# Altium schematic sheet MotherBoard.SchDoc
size A4
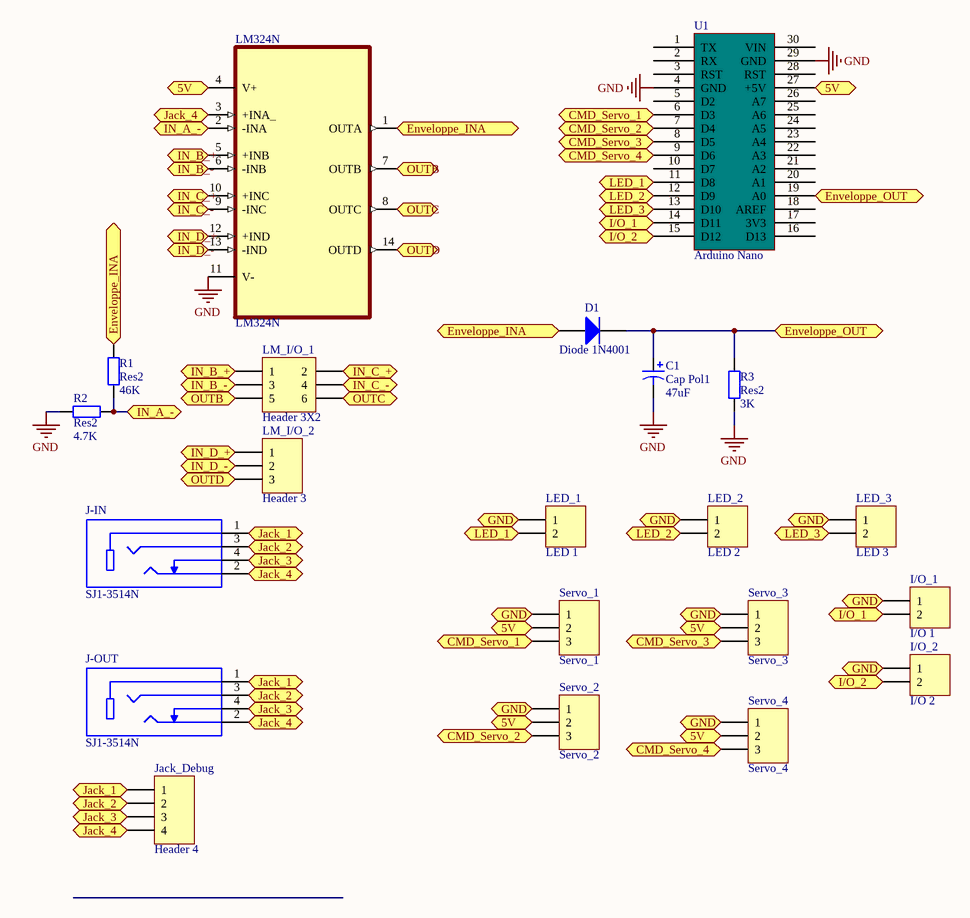
[diagram p0: MotherBoard.SchDoc]

## Parts
C1  Cap Pol1  value 47uF  [RB7.6-15]
D1  Diode 1N4001  [DO-41]
I/O_1  I/O 1  [HDR1X2]
I/O_2  I/O 2  [HDR1X2]
J-IN  SJ1-3514N  [CUI_SJ1-3514N]
J-OUT  SJ1-3514N  [CUI_SJ1-3514N]
Jack_Debug  Header 4  [HDR1X4]
LED_1  LED 1  [HDR1X2]
LED_2  LED 2  [HDR1X2]
LED_3  LED 3  [HDR1X2]
LM324N  LM324N  [DIP254P762X508-14]
LM_I/O_1  Header 3X2  [HDR2X3]
LM_I/O_2  Header 3  [HDR1X3]
R1  Res2  value 46K  [AXIAL-0.4]
R2  Res2  value 4.7K  [AXIAL-0.4]
R3  Res2  value 3K  [AXIAL-0.4]
Servo_1  Servo_1  [HDR1X3]
Servo_2  Servo_2  [HDR1X3]
Servo_3  Servo_3  [HDR1X3]
Servo_4  Servo_4  [HDR1X3]
U1  Arduino Nano  [PCBComponent_1]

## Ports
5V, CMD_Servo_1, CMD_Servo_2, CMD_Servo_3, CMD_Servo_4, Enveloppe_INA, Enveloppe_OUT, GND, I/O_1, I/O_2, IN_A_-, IN_B_+, IN_B_-, IN_C_+, IN_C_-, IN_D_+, IN_D_-, Jack_1, Jack_2, Jack_3, Jack_4, LED_1, LED_2, LED_3, OUTB, OUTC, OUTD

## Nets
GND: C1.2 LM324N.11(V-) R2.2 R3.1 U1.4(GND) U1.29(GND)
5V: LM324N.4(V+) Servo_1.2 Servo_2.2 Servo_3.2 Servo_4.2 U1.27(+5V) ; port 5V
CMD_Servo_1: Servo_1.3 U1.6(D3) ; port CMD_Servo_1
CMD_Servo_2: Servo_2.3 U1.7(D4) ; port CMD_Servo_2
CMD_Servo_3: Servo_3.3 U1.8(D5) ; port CMD_Servo_3
CMD_Servo_4: Servo_4.3 U1.9(D6) ; port CMD_Servo_4
Enveloppe_INA: D1.1(A) LM324N.1(OUTA) R1.2 ; port Enveloppe_INA
Enveloppe_OUT: C1.1 D1.2(K) R3.2 U1.19(A0) ; port Enveloppe_OUT
GND: I/O_1.1 I/O_2.1 LED_1.1 LED_2.1 LED_3.1 Servo_1.1 Servo_2.1 Servo_3.1 Servo_4.1 ; port GND  [a separate net that carries the same name]
I/O_1: I/O_1.2 U1.14(D11) ; port I/O_1
I/O_2: I/O_2.2 U1.15(D12) ; port I/O_2
IN_A_-: LM324N.2(-INA) R1.1 R2.1 ; port IN_A_-
IN_B_+: LM324N.5(+INB) LM_I/O_1.1 ; port IN_B_+
IN_B_-: LM324N.6(-INB) LM_I/O_1.3 ; port IN_B_-
IN_C_+: LM324N.10(+INC) LM_I/O_1.2 ; port IN_C_+
IN_C_-: LM324N.9(-INC) LM_I/O_1.4 ; port IN_C_-
IN_D_+: LM324N.12(+IND) LM_I/O_2.1 ; port IN_D_+
IN_D_-: LM324N.13(-IND) LM_I/O_2.2 ; port IN_D_-
Jack_1: J-IN.1 J-OUT.1 Jack_Debug.1 ; port Jack_1
Jack_2: J-IN.3 J-OUT.3 Jack_Debug.2 ; port Jack_2
Jack_3: J-IN.4 J-OUT.4 Jack_Debug.3 ; port Jack_3
Jack_4: J-IN.2 J-OUT.2 Jack_Debug.4 LM324N.3(+INA_) ; port Jack_4
LED_1: LED_1.2 U1.11(D8) ; port LED_1
LED_2: LED_2.2 U1.12(D9) ; port LED_2
LED_3: LED_3.2 U1.13(D10) ; port LED_3
OUTB: LM324N.7(OUTB) LM_I/O_1.5 ; port OUTB
OUTC: LM324N.8(OUTC) LM_I/O_1.6 ; port OUTC
OUTD: LM324N.14(OUTD) LM_I/O_2.3 ; port OUTD

Not connected (* = marked no-connect by the designer): U1 1(TX) 2(RX) 3(RST) 5(D2) 10(D7) 16(D13) 17(3V3) 18(AREF) 20(A1) 21(A2) 22(A3) 23(A4) 24(A5) 25(A6) 26(A7) 28(RST) 30(VIN)

## Library data of the parts
C1 = Cap Pol1: Polarized Capacitor (Radial); Published: 8-Jun-2000; LatestRevisionDate: 17-Jul-2002; LatestRevisionNote: Re-released for DXP Platform.; PackageReference: RB7.6-15; Publisher: Altium Limited; PackageDescription: Polarized Capacitor (Radial); 2 Leads
D1 = Diode 1N4001: 1 Amp General Purpose Rectifier; Published: 8-Jun-2000; LatestRevisionDate: 17-Jul-2002; LatestRevisionNote: Re-released for DXP Platform.; DatasheetVersion: 1998; PackageVersion: Aug-1999; PackageReference: DO-41; Publisher: Altium Limited; PackageDescription: Diode, Axial; Body 5.2 x 2.7 mm (LxDia. max), Lead Dia. 0.86 mm (max); Code_JEDEC: DO-204-AL; ComponentLink1Description: Manufacturer Link; ComponentLink1URL: http://www.fairchildsemi.com/; ComponentLink2Description: Datasheet; ComponentLink2URL: http://www.fairchildsemi.com/ds/1N%2F1N4001.pdf
I/O_1 I/O_2 LED_1-LED_3 = Header 2: Header, 2-Pin; LatestRevisionDate: 17-Jul-2002; LatestRevisionNote: Re-released for DXP Platform.; Publisher: Altium Limited
J-IN J-OUT = SJ1-3514N: 3.5 mm, Stereo, Right Angle, Through Hole, Audio Jack Connector; MF: CUI Devices; Price: None; Availability: Unavailable; SnapEDA_Link: https://www.snapeda.com/parts/SJ1-3514N/CUI%20Devices/view-part/617955/?ref=snap; Value: *; Package: None; MP: SJ1-3514N; CUI_purchase_URL: https://www.cuidevices.com/product/interconnect/connectors/audio-connectors/jacks/sj1-351xn-series?utm_source=snapeda.com&utm_medium=referral&utm_campaign=snapedaBOM
Jack_Debug = Header 4: Header, 4-Pin; LatestRevisionDate: 17-Jul-2002; LatestRevisionNote: Re-released for DXP Platform.; Publisher: Altium Limited
LM324N = LM324N: General Purpose Amplifier 4 Circuit 14-PDIP; MP: LM324N/NOPB; MF: Texas Instruments; SnapEDA_Link: https://www.snapeda.com/parts/LM324N/NOPB/Texas%20Instruments/view-part/18367/?ref=snap; Price: None; Package: DIP-14 Texas Instruments; Value: *; Availability: Unavailable
LM_I/O_1 = Header 3X2: Header, 3-Pin, Dual row; LatestRevisionDate: 17-Jul-2002; LatestRevisionNote: Re-released for DXP Platform.; Publisher: Altium Limited
LM_I/O_2 Servo_1-Servo_4 = Header 3: Header, 3-Pin; LatestRevisionDate: 17-Jul-2002; LatestRevisionNote: Re-released for DXP Platform.; Publisher: Altium Limited
R1-R3 = Res2: Resistor; Published: 8-Jun-2000; LatestRevisionDate: 17-Jul-2002; LatestRevisionNote: Re-released for DXP Platform.; PackageReference: AXIAL-0.4; Publisher: Altium Limited; PackageDescription: Axial Device, Thru-Hole; 2 Leads; 0.4 in Pin Spacing
U1 = Component_1